# Altium project Flow_Pump.PrjPcb
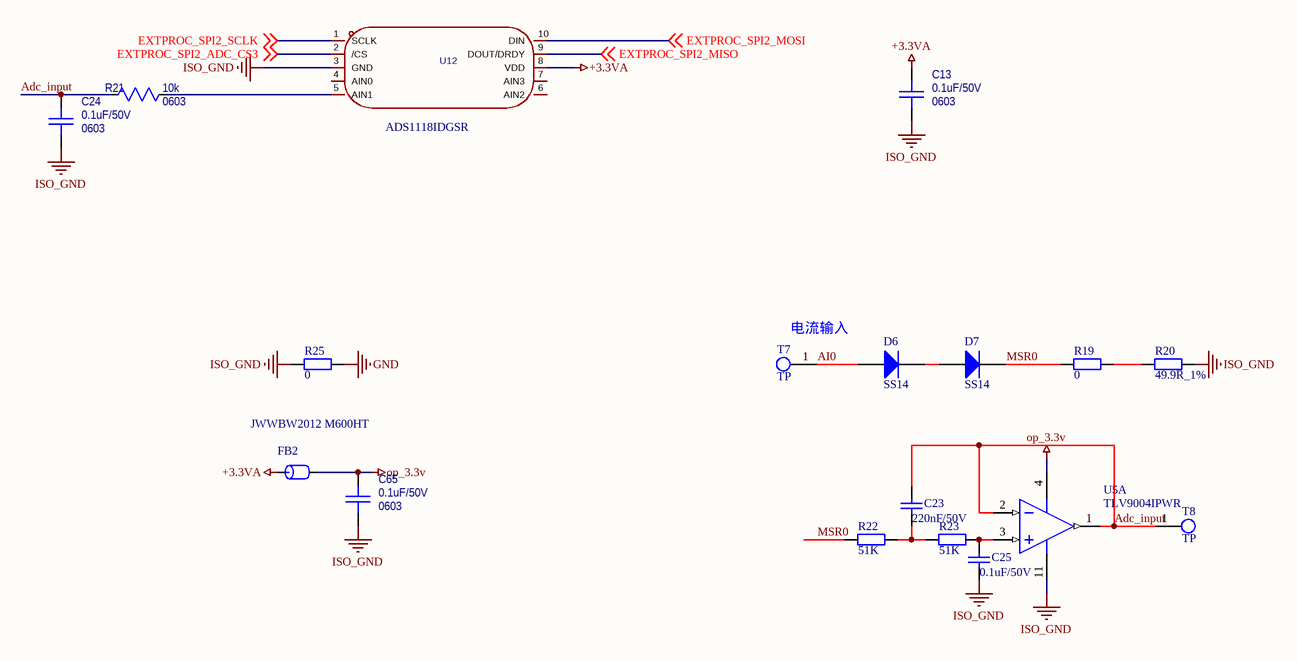
[diagram p0: ai.SchDoc]
5 sheets, 206 parts. Net scope: global (net labels, ports and power ports of the same name join across sheets).
Board file: Flow_Pump.PcbDoc
Sheets:
  ai.SchDoc
  DI_DO.SchDoc
  sensor.SchDoc
  power.SchDoc
  blds.SchDoc

## Sheet ai.SchDoc
size A4; SheetNumber: 3; SheetTotal: 3

### Parts
C13  Package: 0603  [0603C]  (hidden comment: 0.1uF/50V)
C23  220nF/50V  [0603C]
C24  Package: 0603  [0603C]  (hidden comment: 0.1uF/50V)
C25  0.1uF/50V  [0603C]
C65  Package: 0603  [0603C]  (hidden comment: 0.1uF/50V)
D6  SS14  [DO-214AC]
D7  SS14  [DO-214AC]
FB2  JWWBW2012 M600HT  [0805R]
R19  0  [0603R]
R20  49.9R_1%  [0603R]
R21  value 10k  Package: 0603  [0603R]  (hidden comment: 10K/1%)
R22  51K  [0603R]
R23  51K  [0603R]
R25  0  [0603R]
T7  TP  [TPD]
T8  TP  [TPD]
U5  TLV9004IPWR  [TSSOP14]  (part A of 4)
U12  ADS1118IDGSR  [VSSOP-10_L3.0-W3.0-P0.50-LS4.9-BL]

### Nets
+3.3VA: C13.1 FB2.1 U12.8(VDD)
GND: R25.1
ISO_GND: C13.2 C24.2 C25.1 C65.2 R20.1 R25.2 U5.11(GND) U12.3(GND)
op_3.3v: C65.1 FB2.2 U5.4(V+)
Adc_input: C23.2 C24.1 R21.2 T8.1 U5.1(OUT) U5.2(IN-)
AI0: D6.1(A) T7.1
EXTPROC_SPI2_ADC_CS3: U12.2(/CS) ; off-sheet EXTPROC_SPI2_ADC_CS3
EXTPROC_SPI2_MISO: U12.9(DOUT/DRDY) ; off-sheet EXTPROC_SPI2_MISO
EXTPROC_SPI2_MOSI: U12.10(DIN) ; off-sheet EXTPROC_SPI2_MOSI
EXTPROC_SPI2_SCLK: U12.1(SCLK) ; off-sheet EXTPROC_SPI2_SCLK
MSR0: D7.2(K) R19.2 R22.2
NetC23_1: C23.1 R22.1 R23.2
NetC25_2: C25.2 R23.1 U5.3(IN+)
NetD6_2: D6.2(K) D7.1(A)
NetR19_1: R19.1 R20.2
NetR21_1: R21.1 U12.5(AIN1)

Not connected (* = marked no-connect by the designer): U12 4(AIN0) 6(AIN2) 7(AIN3)

### Notes on the sheet
- (near T7) 电流输入

### Library data of the parts
C13 C24 C65 = Capacitor_0603: Capacitor, MLCC; Voltage Rating: [voltage]; Value: 0.1uF/50V
C23 C25 = Cap: Capacitor; Package: 0603
  C25: Value: 0.1uF/50V
D6 D7 = Diode: Default Diode; Package: DO-214AC
FB2 = FB: Package: 0805R
R19 R20 R22 R23 R25 = Res0805M: Package: 0603
R21 = Resistor_0603: Resistor, Standard
U5 = MAX908EPD: Quad High-speed, Ultra Low-power, Single-Supply TTL comparator; Package: TSSOP14
U12 = ADS1118IDGSR_C55347: Package: VSSOP-10_L3.0-W3.0-P0.50-LS4.9-BL
T7 T8 = TP: Package: TPD

## Sheet DI_DO.SchDoc
size A2; SheetNumber: 4; SheetTotal: 4
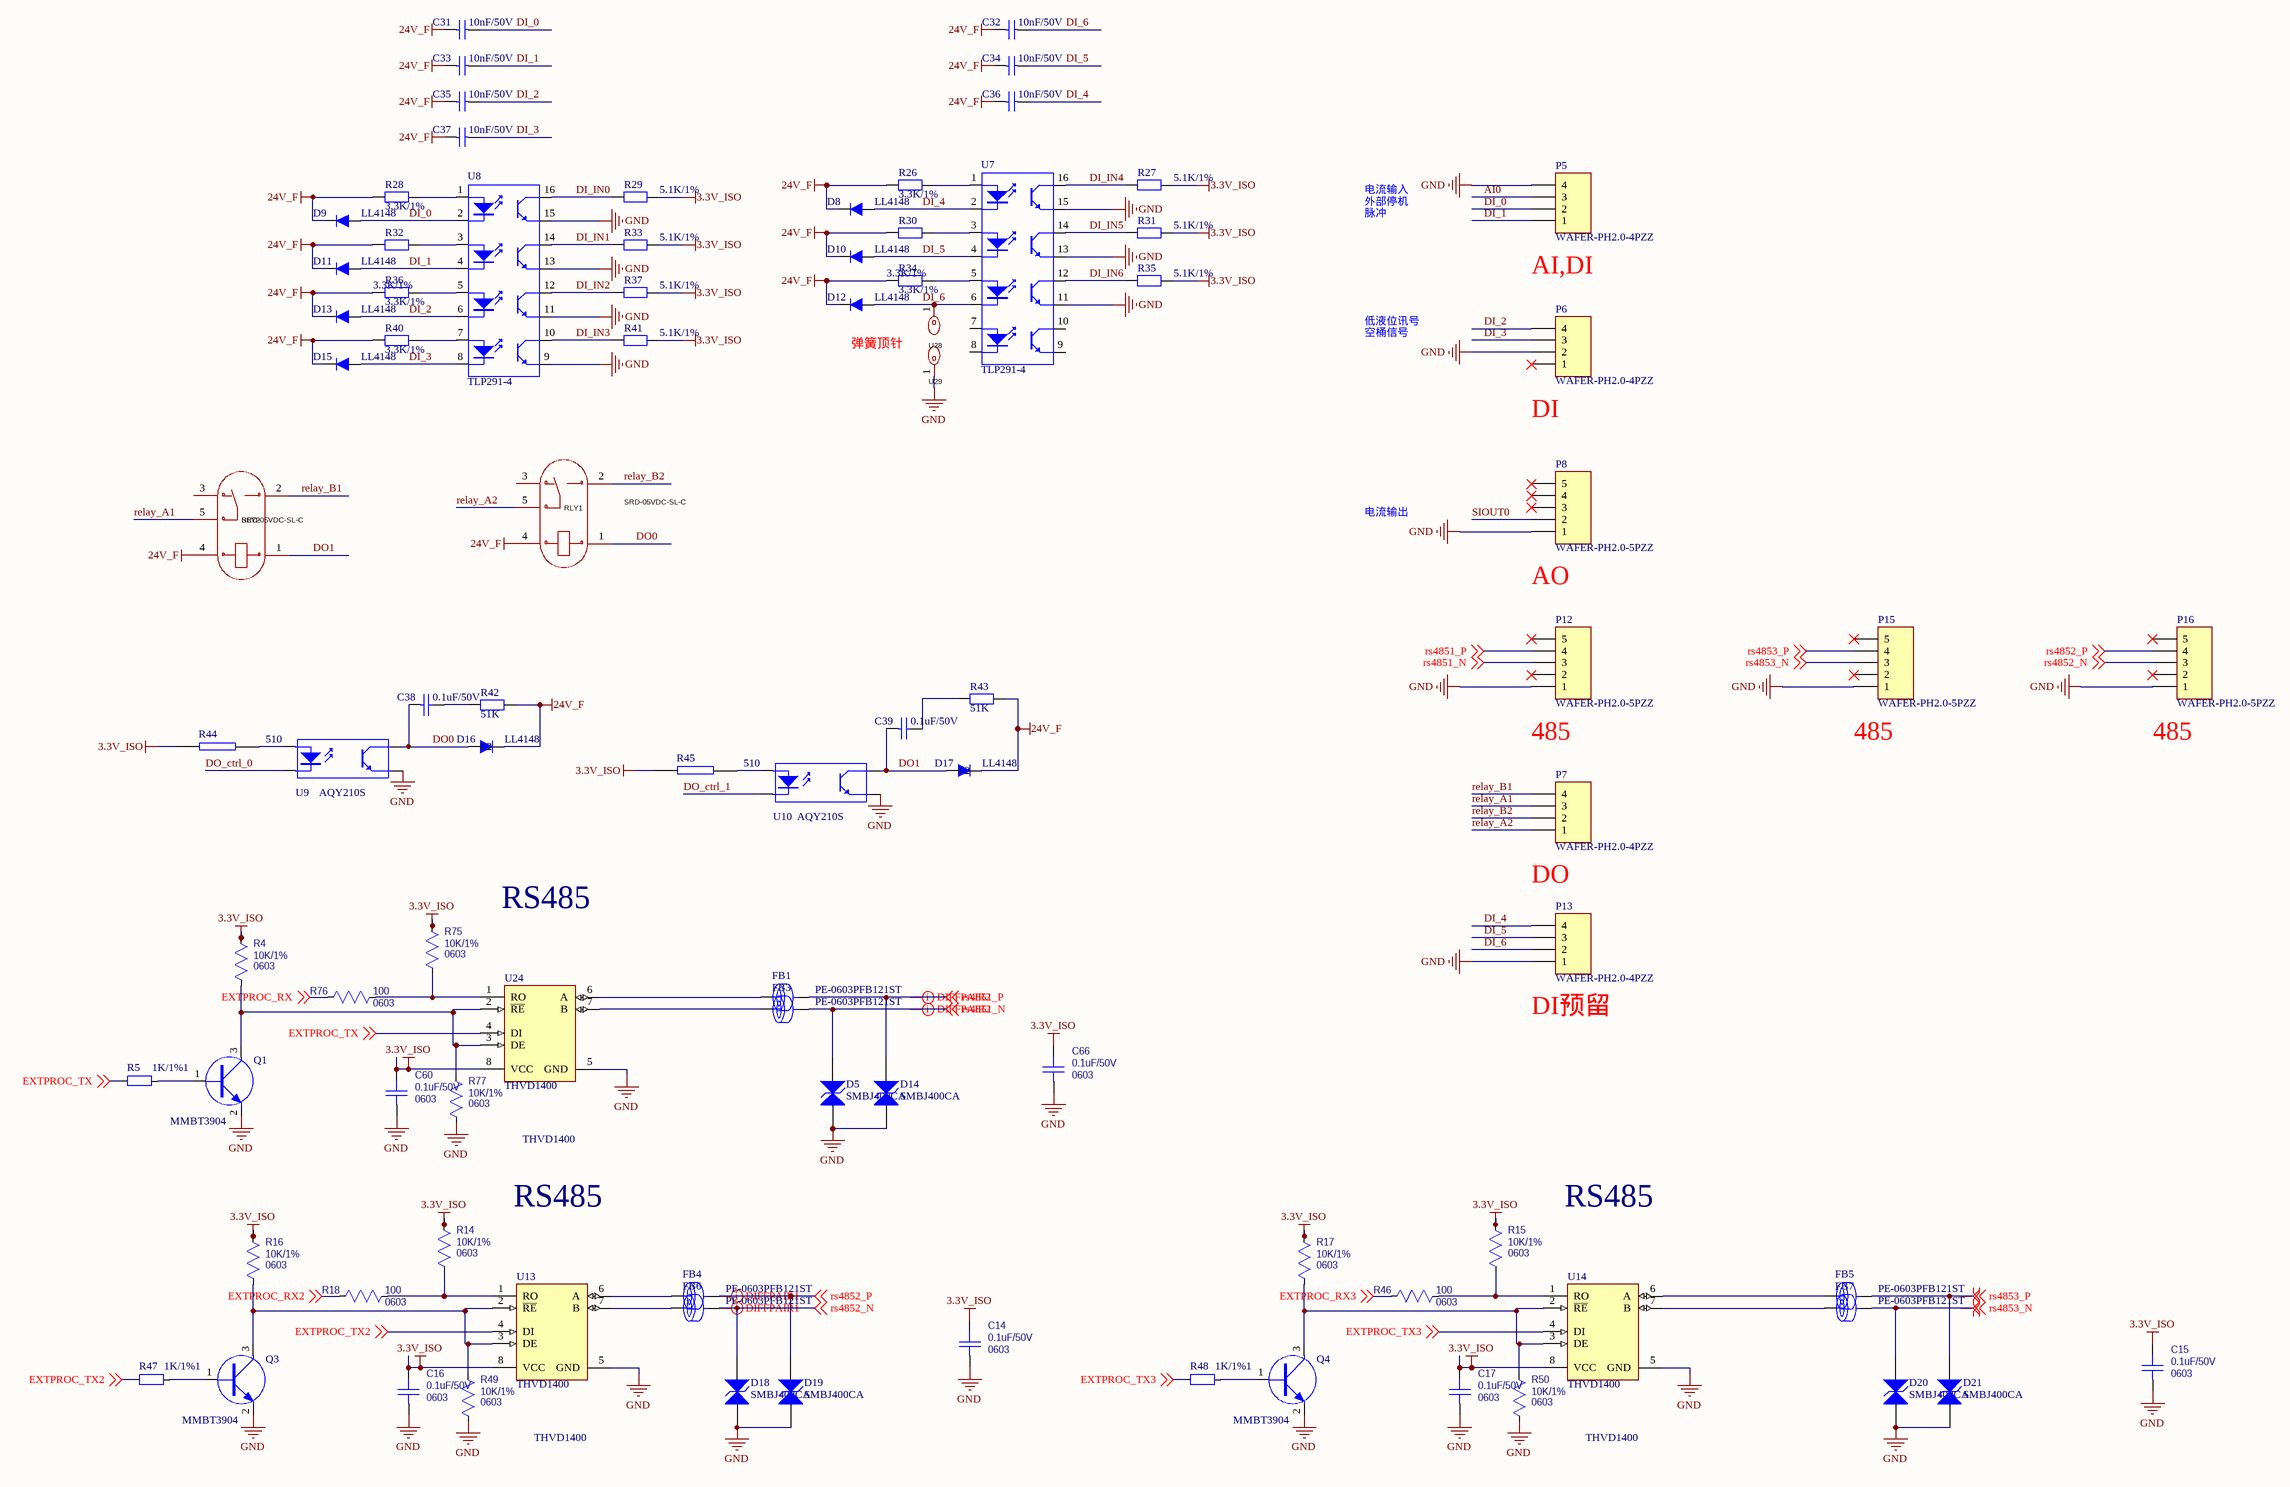
[diagram p1: DI_DO.SchDoc]

### Parts
C14  Package: 0603  [0603C]  (hidden comment: 0.1uF/50V)
C15  Package: 0603  [0603C]  (hidden comment: 0.1uF/50V)
C16  Package: 0603  [0603C]  (hidden comment: 0.1uF/50V)
C17  Package: 0603  [0603C]  (hidden comment: 0.1uF/50V)
C31  10nF/50V  [0603C]
C32  10nF/50V  [0603C]
C33  10nF/50V  [0603C]
C34  10nF/50V  [0603C]
C35  10nF/50V  [0603C]
C36  10nF/50V  [0603C]
C37  10nF/50V  [0603C]
C38  0.1uF/50V  [0603C]
C39  0.1uF/50V  [0603C]
C60  Package: 0603  [0603C]  (hidden comment: 0.1uF/50V)
C66  Package: 0603  [0603C]  (hidden comment: 0.1uF/50V)
D5  SMBJ400CA  [SMB]
D8  LL4148  [DO-213AB/LL34/MiniMELF]
D9  LL4148  [DO-213AB/LL34/MiniMELF]
D10  LL4148  [DO-213AB/LL34/MiniMELF]
D11  LL4148  [DO-213AB/LL34/MiniMELF]
D12  LL4148  [DO-213AB/LL34/MiniMELF]
D13  LL4148  [DO-213AB/LL34/MiniMELF]
D14  SMBJ400CA  [SMB]
D15  LL4148  [DO-213AB/LL34/MiniMELF]
D16  LL4148  [DO-213AB/LL34/MiniMELF]
D17  LL4148  [DO-213AB/LL34/MiniMELF]
D18  SMBJ400CA  [SMB]
D19  SMBJ400CA  [SMB]
D20  SMBJ400CA  [SMB]
D21  SMBJ400CA  [SMB]
FB1  PE-0603PFB121ST  [FBC0603]
FB3  PE-0603PFB121ST  [FBC0603]
FB4  PE-0603PFB121ST  [FBC0603]
FB5  PE-0603PFB121ST  [FBC0603]
FB6  PE-0603PFB121ST  [FBC0603]
FB7  PE-0603PFB121ST  [FBC0603]
P5  WAFER-PH2.0-4PZZ  [CONN#PH2.0-4A]
P6  WAFER-PH2.0-4PZZ  [CONN#PH2.0-4A]
P7  WAFER-PH2.0-4PZZ  [CONN#PH2.0-4A]
P8  WAFER-PH2.0-5PZZ  [CONN#PH2.0-5A]
P12  WAFER-PH2.0-5PZZ  [CONN#PH2.0-5A]
P13  WAFER-PH2.0-4PZZ  [CONN#PH2.0-4A]
P15  WAFER-PH2.0-5PZZ  [CONN#PH2.0-5A]
P16  WAFER-PH2.0-5PZZ  [CONN#PH2.0-5A]
Q1  MMBT3904  [SOT23-3]
Q3  MMBT3904  [SOT23-3]
Q4  MMBT3904  [SOT23-3]
R4  Package: 0603  [0603R]  (hidden comment: 10K/1%)
R5  1K/1%1  [0603r]
R14  Package: 0603  [0603R]  (hidden comment: 10K/1%)
R15  Package: 0603  [0603R]  (hidden comment: 10K/1%)
R16  Package: 0603  [0603R]  (hidden comment: 10K/1%)
R17  Package: 0603  [0603R]  (hidden comment: 10K/1%)
R18  Package: 0603  [0603R]  (hidden comment: 100)
R26  3.3K/1%  [0603R]
R27  5.1K/1%  [0603R]
R28  3.3K/1%  [0603R]
R29  5.1K/1%  [0603R]
R30  3.3K/1%  [0603R]
R31  5.1K/1%  [0603R]
R32  3.3K/1%  [0603R]
R33  5.1K/1%  [0603R]
R34  3.3K/1%  [0603R]
R35  5.1K/1%  [0603R]
R36  3.3K/1%  [0603R]
R37  5.1K/1%  [0603R]
R40  3.3K/1%  [0603R]
R41  5.1K/1%  [0603R]
R42  51K  [0603R]
R43  51K  [0603R]
R44  510  [0603R]
R45  510  [0603R]
R46  Package: 0603  [0603R]  (hidden comment: 100)
R47  1K/1%1  [0603r]
R48  1K/1%1  [0603r]
R49  Package: 0603  [0603R]  (hidden comment: 10K/1%)
R50  Package: 0603  [0603R]  (hidden comment: 10K/1%)
R75  Package: 0603  [0603R]  (hidden comment: 10K/1%)
R76  Package: 0603  [0603R]  (hidden comment: 100)
R77  Package: 0603  [0603R]  (hidden comment: 10K/1%)
RLY1  SRD-05VDC-SL-C  [RELAY-TH_SRD-XXVDC-XL-C]
RLY2  SRD-05VDC-SL-C  [RELAY-TH_SRD-XXVDC-XL-C]
U7  TLP291-4  [SOP16-T]
U8  TLP291-4  [SOP16-T]
U9  AQY210S  [sop4]
U10  AQY210S  [sop4]
U13  THVD1400  [MAXM-S8+4_M]
U14  THVD1400  [MAXM-S8+4_M]
U24  THVD1400  [MAXM-S8+4_M]
U28  (no value)  [CONN-SMD_YTC1P-3015-01]
U29  (no value)  [CONN-SMD_YTC1P-3015-01]

### Nets
3.3V_ISO: C14.1 C15.1 C16.1 C17.1 C60.1 C66.1 R4.2 R14.2 R15.2 R16.2 R17.2 R27.1 R29.1 R31.1 R33.1 R35.1 R37.1 R41.1 R44.2 R45.2 R75.2 U13.8(VCC) U14.8(VCC) U24.8(VCC)  [project net +3.3VA]
24V_F: C31.1 C32.1 C33.1 C34.1 C35.1 C36.1 C37.1 D8.2 D9.2 D10.2 D11.2 D12.2 D13.2 D15.2 D16.2(1) D17.2(1) R26.2 R28.2 R30.2 R32.2 R34.2 R36.2 R40.2 R42.2 R43.2 RLY1.4 RLY2.4
GND: C14.2 C15.2 C16.2 C17.2 C60.2 C66.2 D5.1(A) D14.1(A) D18.1(A) D19.1(A) D20.1(A) D21.1(A) P5.4 P6.2 P8.1 P12.1 P13.1 P15.1 P16.1 Q1.2(E) Q3.2(E) Q4.2(E) R49.1 R50.1 R77.1 U7.11(E) U7.13(E) U7.15(E) U8.9(E) U8.11(E) U8.13(E) U8.15(E) U9.3(E) U10.3(E) U13.5(GND) U14.5(GND) U24.5(GND) U29.1
AI0: P5.3
DI_0: C31.2 D9.1 P5.2 U8.2(K)
DI_1: C33.2 D11.1 P5.1 U8.4(K)
DI_2: C35.2 D13.1 P6.4 U8.6(K)
DI_3: C37.2 D15.1 P6.3 U8.8(K)
DI_4: C36.2 D8.1 P13.4 U7.2(K)
DI_5: C34.2 D10.1 P13.3 U7.4(K)
DI_6: C32.2 D12.1 P13.2 U7.6(K) U28.1
DI_IN0: R29.2 U8.16(C)
DI_IN1: R33.2 U8.14(C)
DI_IN2: R37.2 U8.12(C)
DI_IN3: R41.2 U8.10(C)
DI_IN4: R27.2 U7.16(C)
DI_IN5: R31.2 U7.14(C)
DI_IN6: R35.2 U7.12(C)
DO0: C38.1 D16.1(2) RLY1.1 U9.4(C)
DO1: C39.1 D17.1(2) RLY2.1 U10.4(C)
DO_ctrl_0: U9.2(K)
DO_ctrl_1: U10.2(K)
EXTPROC_RX: R76.2 ; off-sheet EXTPROC_RX
EXTPROC_RX2: R18.2 ; off-sheet EXTPROC_RX2
EXTPROC_RX3: R46.2 ; off-sheet EXTPROC_RX3
EXTPROC_TX: R5.1 U24.4(DI) ; off-sheet EXTPROC_TX
EXTPROC_TX2: R47.1 U13.4(DI) ; off-sheet EXTPROC_TX2
EXTPROC_TX3: R48.1 U14.4(DI) ; off-sheet EXTPROC_TX3
relay_A1: P7.3 RLY2.5
relay_A2: P7.1 RLY1.5
relay_B1: P7.4 RLY2.2
relay_B2: P7.2 RLY1.2
rs4851_N: D5.2(A) FB3.2 P12.3 ; off-sheet rs4851_N
rs4851_P: D14.2(A) FB1.2 P12.4 ; off-sheet rs4851_P
rs4852_N: D18.2(A) FB6.2 P16.3 ; off-sheet rs4852_N
rs4852_P: D19.2(A) FB4.2 P16.4 ; off-sheet rs4852_P
rs4853_N: D20.2(A) FB7.2 P15.3 ; off-sheet rs4853_N
rs4853_P: D21.2(A) FB5.2 P15.4 ; off-sheet rs4853_P
SIOUT0: P8.2
NetC38_2: C38.2 R42.1
NetC39_2: C39.2 R43.1
NetFB1_1: FB1.1 U24.6(A)
NetFB3_1: FB3.1 U24.7(B)
NetFB4_1: FB4.1 U13.6(A)
NetFB5_1: FB5.1 U14.6(A)
NetFB6_1: FB6.1 U13.7(B)
NetFB7_1: FB7.1 U14.7(B)
NetQ1_1: Q1.1(B) R5.2
NetQ1_3: Q1.3(C) R4.1 R77.2 U24.2(~{RE}) U24.3(DE)
NetQ3_1: Q3.1(B) R47.2
NetQ3_3: Q3.3(C) R16.1 R49.2 U13.2(~{RE}) U13.3(DE)
NetQ4_1: Q4.1(B) R48.2
NetQ4_3: Q4.3(C) R17.1 R50.2 U14.2(~{RE}) U14.3(DE)
NetR14_1: R14.1 R18.1 U13.1(RO)
NetR15_1: R15.1 R46.1 U14.1(RO)
NetR26_1: R26.1 U7.1(A)
NetR28_1: R28.1 U8.1(A)
NetR30_1: R30.1 U7.3(A)
NetR32_1: R32.1 U8.3(A)
NetR34_1: R34.1 U7.5(A)
NetR36_1: R36.1 U8.5(A)
NetR40_1: R40.1 U8.7(A)
NetR44_1: R44.1 U9.1(A)
NetR45_1: R45.1 U10.1(A)
NetR75_1: R75.1 R76.1 U24.1(RO)

Not connected (* = marked no-connect by the designer): P6 1*; P8 3* 4* 5*; P12 2* 5*; P15 2* 5*; P16 2* 5*; RLY1 3; RLY2 3; U7 7(A) 8(K) 9(E) 10(C)

### Layout directives
differential pair: rs4851_N, rs4851_P, rs4852_N, rs4852_P, rs4853_N, rs4853_P

### Notes on the sheet
- 电流输入
- 外部停机
- 脉冲
- AI,DI
- (near D12) 弹簧顶针
- 低液位讯号
- 空桶信号
- (near P6) DI
- 电流输出
- AO
- 485
- (near P15) 485
- (near P16) 485
- DO
- RS485
- (near P13) DI预留
- THVD1400

### Library data of the parts
C14-C17 C60 C66 = Capacitor_0603: as C13 on sheet ai; Value: 0.1uF/50V
C31-C37 = Cap: Capacitor; Value: 10nF/50V; Package: 0603
C38 C39 = CAP: Capacitor; Package: 0603; Value: 0.1uF/50V
D5 D14 D18-D21 = SMAJ12CA: Transient Voltage Suppression Diode, 400 W, 33 V, -65 to 150 degC, 2-Pin SMD, RoHS, Tape and Reel; Value: SMBJ400CA; Package: SMB
D8-D13 D15-D17 = LL4148: VISHAY,LL4148,圆柱体MiniMELF100V/2A,ROHS; 版本: V1.00; 名称: 快速开关二极管; 物料编号: APLLY; 制造商: VISHAY; Package: DO-213AB/LL34/MiniMELF
FB1 FB3-FB7 = FBC0603: Ferrite Bead Chip; Value: PE-0603PFB121ST; Package: FBC0603
P5-P7 P13 = Header 4: Header, 4-Pin; Package: CONN#PH2.0-4A
P8 P12 P15 P16 = Header 5: Header, 5-Pin; Package: CONN#PH2.0-5A
Q1 Q3 Q4 = NPN_MMBT3904: Package: SOT23-3
R4 R14-R18 R46 R49 R50 R75-R77 = Resistor_0603: Resistor, Standard
  R4 R14-R17 R49 R50 R75 R77: Value: 10K/1%
  R18 R46 R76: Value: 100
R5 R47 R48 = RES0603: 物料主编码(PN): 150000040; Value: 1K; 序号: 109; 物料名称: 贴片电阻; 精度: ±1%; 规格型号(完整型号): RC1608F103CS/RC0603FR-0710KL; 物料描述: RES,贴片电阻,0603,10k,±1%,1/10W,1.6X0.8X0.45mm,RC1608F103CS/RC0603FR-0710KL; 工作温度: –55°C to 155°C; 制造商: 三星/YAGEO; 器件等级: ——; 物料类型: 表贴电阻; 参数值: 1.00E+04; Package: 0603
R26-R37 R40-R43 = Res0805M: Package: 0603
R44 R45 = RES2: Package: 0603
U7 U8 = TLP281-4: Package: SOP16-T
U9 U10 = Optoisolator1: 4-Pin Phototransistor Optocoupler; Package: sop4
U13 U14 U24 = MAX33071EASA+: RS-485 Half-Duplex Transceiver with ±65V Fault Protection,+3V to +5.5V, -40 to 125 degC, 8-Pin SOIC (S8+4), RoHS, Tube; VOUT: 3.000 V; VIN: 3.2 to 12.6 V; Value: MAX33071EASA+; Package: MAXM-S8+4_M
U28 U29 = YTC1P-3015-01: Package: CONN-SMD_YTC1P-3015-01
RLY1 RLY2 = SRD-05VDC-SL-C: Package: RELAY-TH_SRD-XXVDC-XL-C

## Sheet sensor.SchDoc
size A3
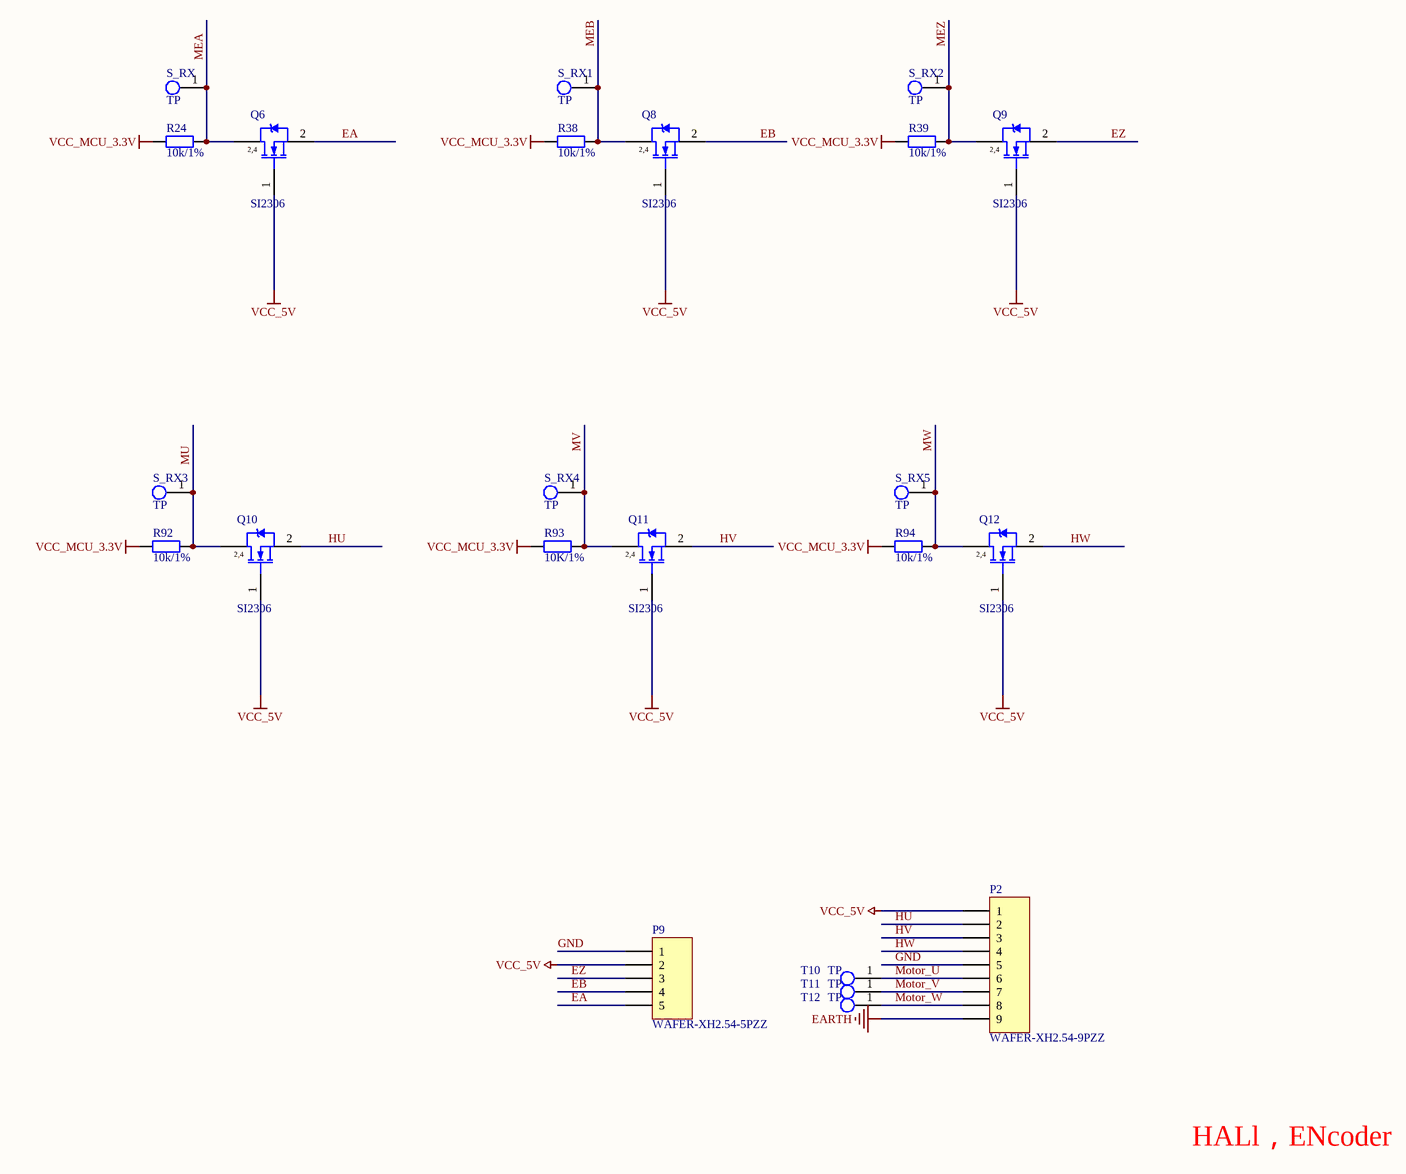
[diagram p2: sensor.SchDoc]

### Parts
P2  WAFER-XH2.54-9PZZ  [XA2.5-9P]
P9  WAFER-XH2.54-5PZZ  [XA2.5-5P]
Q6  SI2306  [SOT23-3]
Q8  SI2306  [SOT23-3]
Q9  SI2306  [SOT23-3]
Q10  SI2306  [SOT23-3]
Q11  SI2306  [SOT23-3]
Q12  SI2306  [SOT23-3]
R24  10k/1%  [0603R]
R38  10k/1%  [0603R]
R39  10k/1%  [0603R]
R92  10k/1%  [0603R]
R93  10K/1%  [0603R]
R94  10k/1%  [0603R]
S_RX  TP  [TPD]
S_RX1  TP  [TPD]
S_RX2  TP  [TPD]
S_RX3  TP  [TPD]
S_RX4  TP  [TPD]
S_RX5  TP  [TPD]
T10  TP  [TPD]
T11  TP  [TPD]
T12  TP  [TPD]

### Nets
EARTH: P2.9
GND: P2.5 P9.1
VCC_5V: P2.1 P9.2 Q6.1(G) Q8.1(G) Q9.1(G) Q10.1(G) Q11.1(G) Q12.1(G)
VCC_MCU_3.3V: R24.1 R38.1 R39.1 R92.1 R93.1 R94.1
EA: P9.5 Q6.2(S)
EB: P9.4 Q8.2(S)
EZ: P9.3 Q9.2(S)
HU: P2.2 Q10.2(S)
HV: P2.3 Q11.2(S)
HW: P2.4 Q12.2(S)
MEA: Q6.3(D) R24.2 S_RX.1
MEB: Q8.3(D) R38.2 S_RX1.1
MEZ: Q9.3(D) R39.2 S_RX2.1
Motor_U: P2.6 T10.1  [project net GSA]
Motor_V: P2.7 T11.1  [project net GSB]
Motor_W: P2.8 T12.1  [project net GSC]
MU: Q10.3(D) R92.2 S_RX3.1
MV: Q11.3(D) R93.2 S_RX4.1
MW: Q12.3(D) R94.2 S_RX5.1

### Notes on the sheet
- HALl，ENcoder
- (in symbol BUK92150-55A) 2,4

### Library data of the parts
P2 = Header 9: Header, 9-Pin; Package: XA2.5-9P
P9 = Header 5: Header, 5-Pin; Package: XA2.5-5P
Q6 Q8-Q12 = BUK92150-55A: Package: SOT23-3
R24 R38 R39 R92-R94 = Res2: Resistor; Package: 0603
S_RX S_RX1-S_RX5 T10-T12 = TP: Package: TPD

## Sheet power.SchDoc
size A2; SPICEModelCacheUWPXBFBI: <root> / <DocumentId>UWPXBFBI</DocumentId> / </root>
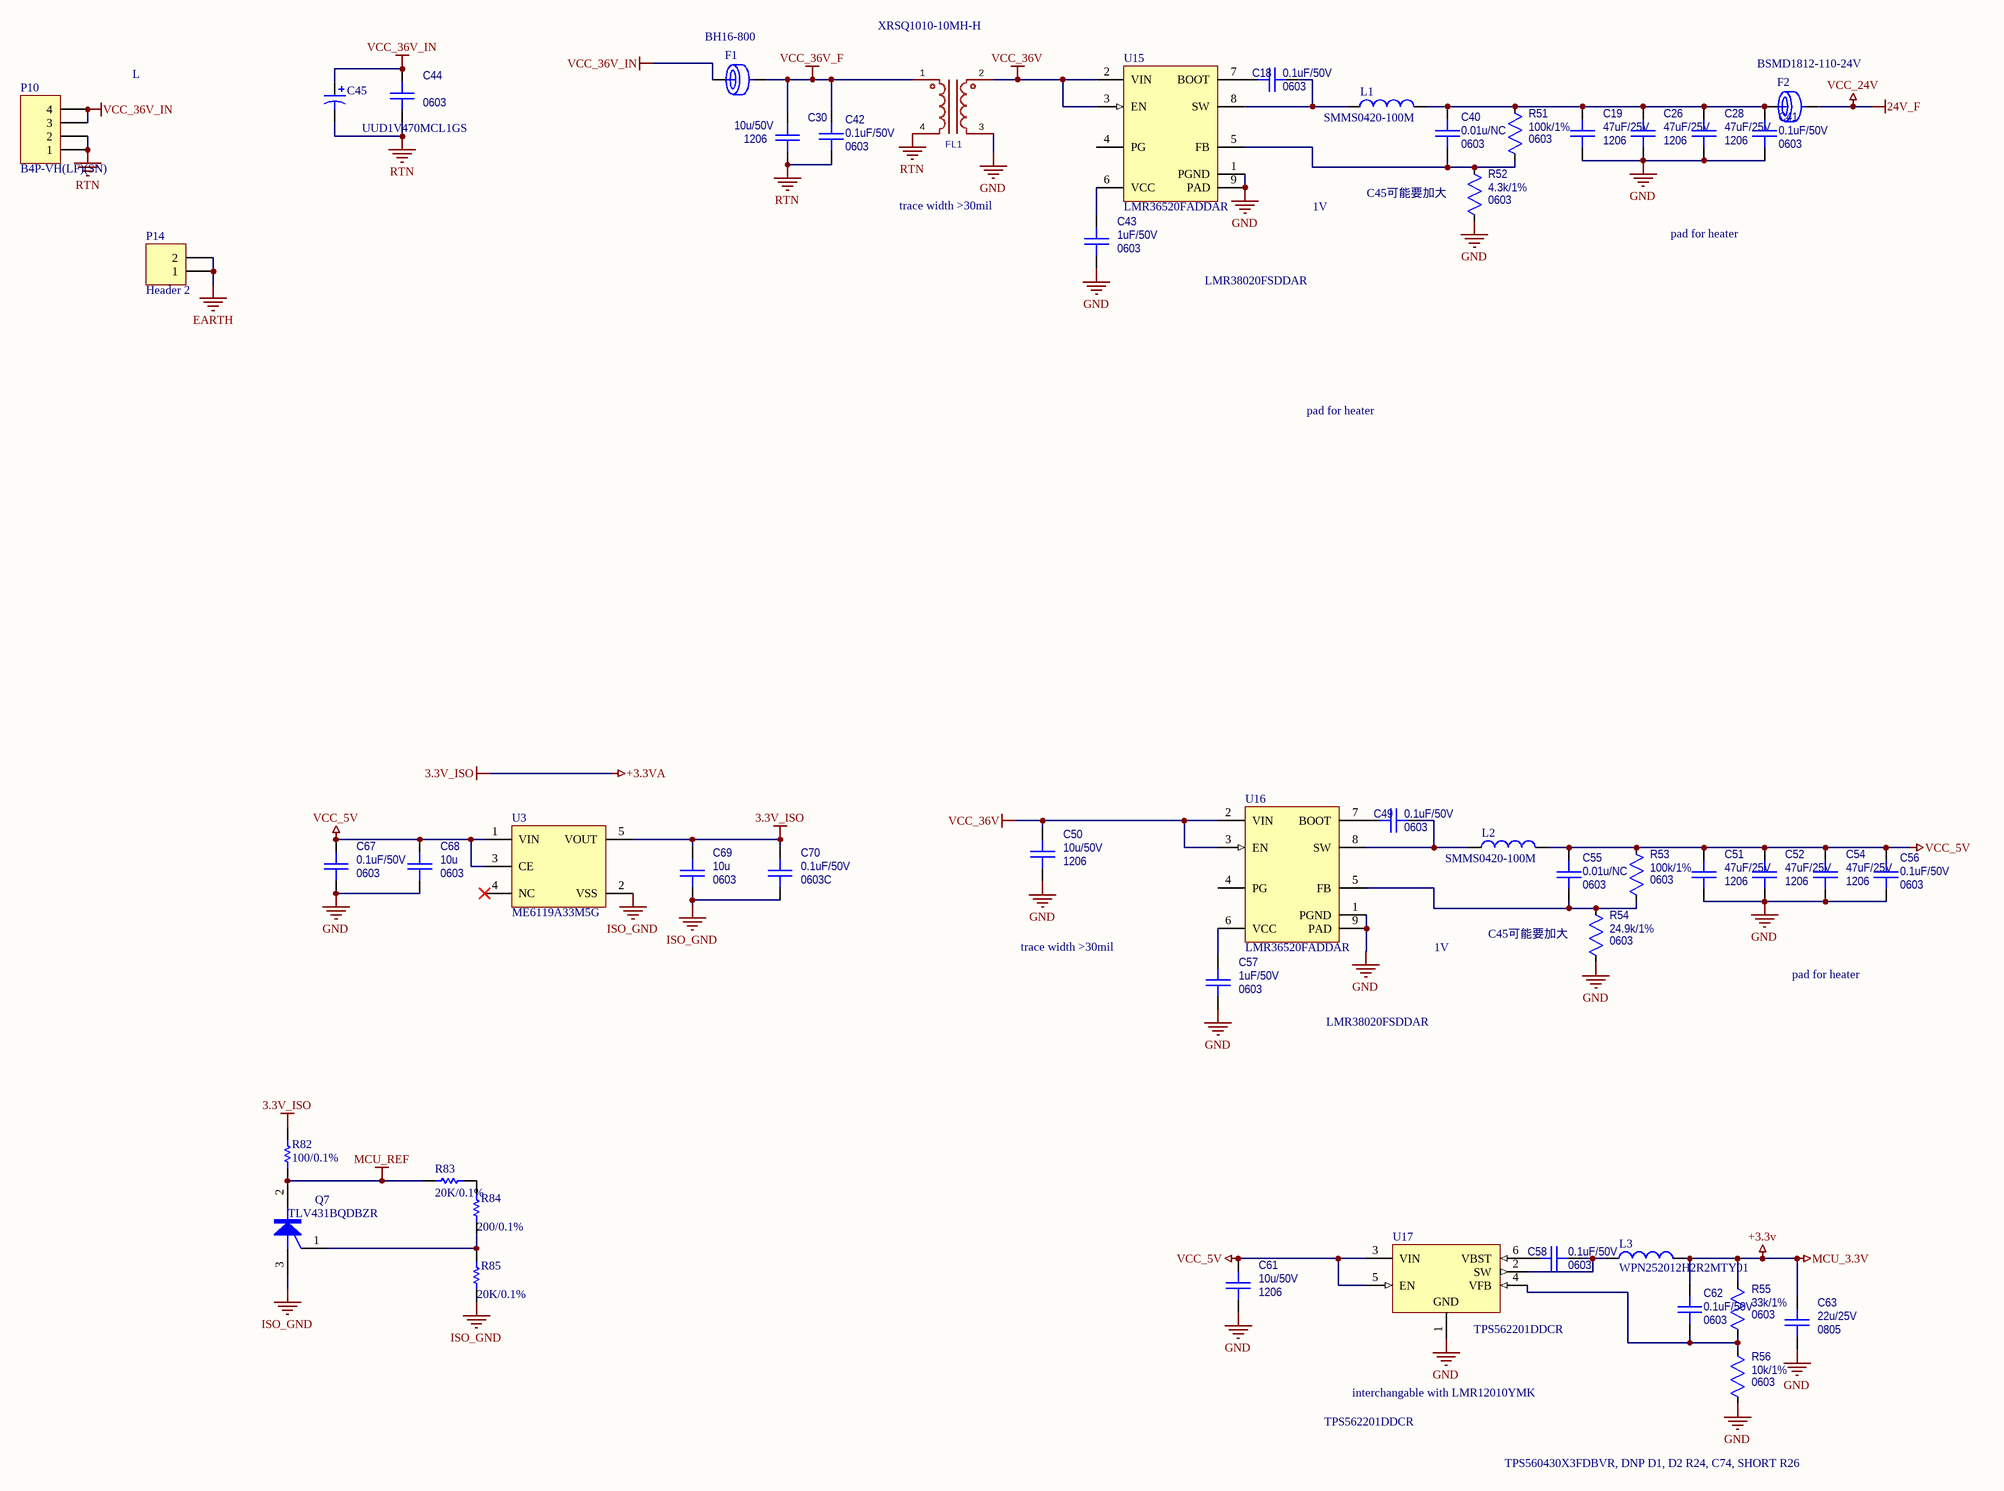
[diagram p3: power.SchDoc]

### Parts
C18  Package: 0603  [0603C]  (hidden comment: 0.1uF/50V)
C19  Package: 1206  [CAPC3216X156N_1206]  (hidden comment: 47uF/25V)
C26  Package: 1206  [CAPC3216X156N_1206]  (hidden comment: 47uF/25V)
C28  Package: 1206  [CAPC3216X156N_1206]  (hidden comment: 47uF/25V)
C30  Package: 1206  [CAPC3216X156N_1206]  (hidden comment: 10u/50V)
C40  value 0.01u/NC  Package: 0603  [0603C]  (hidden comment: 0.01uF/50V)  (no BOM)
C41  Package: 0603  [0603C]  (hidden comment: 0.1uF/50V)
C42  Package: 0603  [0603C]  (hidden comment: 0.1uF/50V)
C43  Package: 0603  [0603C]  (hidden comment: 1uF/50V)
C44  Package: 0603  [0603c]  (hidden comment: 10uF/16V)
C45  UUD1V470MCL1GS  [Φ10×10]
C49  Package: 0603  [0603C]  (hidden comment: 0.1uF/50V)
C50  Package: 1206  [CAPC3216X156N_1206]  (hidden comment: 10u/50V)
C51  Package: 1206  [CAPC3216X156N_1206]  (hidden comment: 47uF/25V)
C52  Package: 1206  [CAPC3216X156N_1206]  (hidden comment: 47uF/25V)
C54  Package: 1206  [CAPC3216X156N_1206]  (hidden comment: 47uF/25V)
C55  value 0.01u/NC  Package: 0603  [0603C]  (hidden comment: 0.01uF/50V)  (no BOM)
C56  Package: 0603  [0603C]  (hidden comment: 0.1uF/50V)
C57  Package: 0603  [0603C]  (hidden comment: 1uF/50V)
C58  Package: 0603  [0603C]  (hidden comment: 0.1uF/50V)
C61  Package: 1206  [CAPC3216X156N_1206]  (hidden comment: 10u/50V)
C62  Package: 0603  [0603C]  (hidden comment: 0.1uF/50V)  (no BOM)
C63  Package: 0805  [CAPC2012X127N_0805]  (hidden comment: 22u/25V)
C67  Package: 0603  [0603C]  (hidden comment: 0.1uF/50V)
C68  value 10u  Package: 0603  [0603c]  (hidden comment: 10uF/16V)
C69  value 10u  Package: 0603  [0603c]  (hidden comment: 10uF/16V)
C70  0.1uF/50V  [0603C]
F1  BH16-800  [FUSE-TH_L14.0-W3.0-P5.10-D0.8-LS1.20]
F2  BSMD1812-110-24V  [1812-F]
FL1  XRSQ1010-10MH-H  [IND-TH_4P-L14.0-W12.0_XRSQ1010-10MH-H]
L1  SMMS0420-100M  [IND-SMD_L4.5-W4.5_SMMS0420]
L2  SMMS0420-100M  [IND-SMD_L4.5-W4.5_SMMS0420]
L3  WPN252012H2R2MTY01  [PULS-BDCD00252012_V]
P10  B4P-VH(LF)(SN)  [CONN-TH_4P-P3.96_HX-VH3.96-4P-ZZ]
P14  Header 2  [插片端子4.8*0.8mm]
Q7  TLV431BQDBZR  [SOT23-3]
R51  Package: 0603  [0603R]  (hidden comment: 100k/1%)
R52  Package: 0603  [0603R]  (hidden comment: 4.3k/1%)
R53  Package: 0603  [0603R]  (hidden comment: 100k/1%)
R54  Package: 0603  [0603R]  (hidden comment: 24.9k/1%)
R55  Package: 0603  [0603R]  (hidden comment: 33k/1%)
R56  Package: 0603  [0603R]  (hidden comment: 10k/1%)
R82  100/0.1%  [0603R]
R83  20K/0.1%  [0603R]
R84  200/0.1%  [0603R]
R85  20K/0.1%  [0603R]
U3  ME6119A33M5G  [MCRN-SOT23-5_V]
U15  LMR36520FADDAR  [DDA0008A_M]
U16  LMR36520FADDAR  [DDA0008A_M]
U17  TPS562201DDCR  [DDC0006A_L]

### Nets
24V_F: F2.2  [also labelled VCC_24V]
+3.3v: C62.1 C63.1 L3.2 R55.2  [also labelled MCU_3.3V]
+3.3VA: C69.1 C70.1 R82.1 U3.5(VOUT)  [also labelled 3.3V_ISO]
EARTH: P14.1 P14.2
GND: C19.2 C26.2 C28.2 C41.2 C43.2 C50.2 C51.2 C52.2 C54.2 C56.2 C57.2 C61.2 C63.2 C67.2 C68.2 FL1.3 R52.1 R54.1 R56.1 U15.1(PGND) U15.9(PAD) U16.1(PGND) U16.9(PAD) U17.1(GND)
ISO_GND: C69.2 C70.2 Q7.3(A) R85.2 U3.2(VSS)
MCU_REF: Q7.2(K) R82.2 R83.1
RTN: C30.2 C42.2 C44.2 C45.2 FL1.4 P10.1 P10.2
VCC_5V: C51.1 C52.1 C54.1 C55.1 C56.1 C61.1 C67.1 C68.1 L2.2 R53.2 U3.1(VIN) U3.3(CE) U17.3(VIN) U17.5(EN)
VCC_36V: C50.1 FL1.2 U15.2(VIN) U15.3(EN) U16.2(VIN) U16.3(EN)
VCC_36V_F: C30.1 C42.1 F1.2 FL1.1
VCC_36V_IN: C44.1 C45.1 F1.1 P10.3 P10.4
NetC18_1: C18.1 U15.7(BOOT)
NetC18_2: C18.2 L1.1 U15.8(SW)
NetC19_1: C19.1 C26.1 C28.1 C40.1 C41.1 F2.1 L1.2 R51.2
NetC40_2: C40.2 R51.1 R52.2 U15.5(FB)
NetC43_1: C43.1 U15.6(VCC)
NetC49_1: C49.1 U16.7(BOOT)
NetC49_2: C49.2 L2.1 U16.8(SW)
NetC55_2: C55.2 R53.1 R54.2 U16.5(FB)
NetC57_1: C57.1 U16.6(VCC)
NetC58_1: C58.1 U17.6(VBST)
NetC58_2: C58.2 L3.1 U17.2(SW)
NetC62_2: C62.2 R55.1 R56.2 U17.4(VFB)
NetQ7_1: Q7.1(G) R84.2 R85.1
NetR83_2: R83.2 R84.1

Not connected (* = marked no-connect by the designer): U3 4(NC)*; U15 4(PG); U16 4(PG)

### Notes on the sheet
- L
- C45可能要加大
- trace width >30mil
- 1V
- pad for heater
- LMR38020FSDDAR
- interchangable with LMR12010YMK
- TPS562201DDCR
- TPS560430X3FDBVR, DNP D1, D2 R24, C74, SHORT R26

### Library data of the parts
C18 C40-C43 C49 C55-C58 C62 = Capacitor_0603: Voltage Rating: [voltage]
  C18 C41 C42 C49 C56 C58 C62: Value: 0.1uF/50V
  C43 C57: Value: 1uF/50V
C19 C26 C28 C30 C50-C52 C54 = Capacitor_1206: Voltage Rating: [voltage]
  C19 C26 C28 C51 C52 C54: Value: 47uF/25V
  C30 C50: Value: 10u/50V
C44 C67-C69 = Capacitor_0603: as C13 on sheet ai
  C67: Value: 0.1uF/50V
C45 = Cap Pol1: Polarized Capacitor (Radial); Value: 220uF/50V; Package: Φ10×10
C61 C63 = Capacitor_0805: Voltage Rating: [voltage]
  C61: Value: 10u/50V
  C63: Value: 22u/25V
C70 = Capacitor_0402: Capacitor, MLCC; Voltage Rating: [voltage]; Package: 0603C; Value: 0.1uF/50V
F1 = FBC0603: Ferrite Bead Chip; Value: BSMD1812-110-24V; Package: FUSE-TH_L14.0-W3.0-P5.10-D0.8-LS1.20
F2 = FBC0603: Ferrite Bead Chip; Value: BSMD1812-110-24V; Package: 1812-F
L1 L2 = 1276AS-H-100M=P2: Metal alloy Power Inductor, 10 uH, ±20%, 1210 (3225); Value: SMMS0420-100M; Package: IND-SMD_L4.5-W4.5_SMMS0420
L3 = BDCD002520122R2MS1: Value: BDCD002520122R2MS1; Package: PULS-BDCD00252012_V
P10 = Header 4: Header, 4-Pin; Package: CONN-TH_4P-P3.96_HX-VH3.96-4P-ZZ
P14 = Header 2: Header, 2-Pin; Package: 插片端子4.8*0.8mm
Q7 = PUT: Programmable Unijunction Transistor; Package: SOT23-3
R51-R56 = Resistor_0603
  R51 R53: Value: 100k/1%
  R52: Value: 4.3k/1%
  R54: Value: 24.9k/1%
  R55: Value: 33k/1%
  R56: Value: 10k/1%
R82-R85 = Res1: Resistor; Package: 0603
  R83 R85: Value: 20K/0.1%
  R84: Value: 200/0.1%
U3 = ME6119C50M5G: High Speed LDO Regulators, Low ESR, 5.0 V, 400 mA, -40 to 125 degC, 5-Pin SOT-23, RoHS, Tape and Reel; Package: MCRN-SOT23-5_V
FL1 = XRSQ1010-10MH-H: Package: IND-TH_4P-L14.0-W12.0_XRSQ1010-10MH-H
U15 U16 = LMR36520FADDAR: Value: LMR36520FADDAR; Package: DDA0008A_M
U17 = TPS562201DDCR: Width: 1.01 mm; Value: TPS562201DDCR; Package: DDC0006A_L

## Sheet blds.SchDoc
size A2
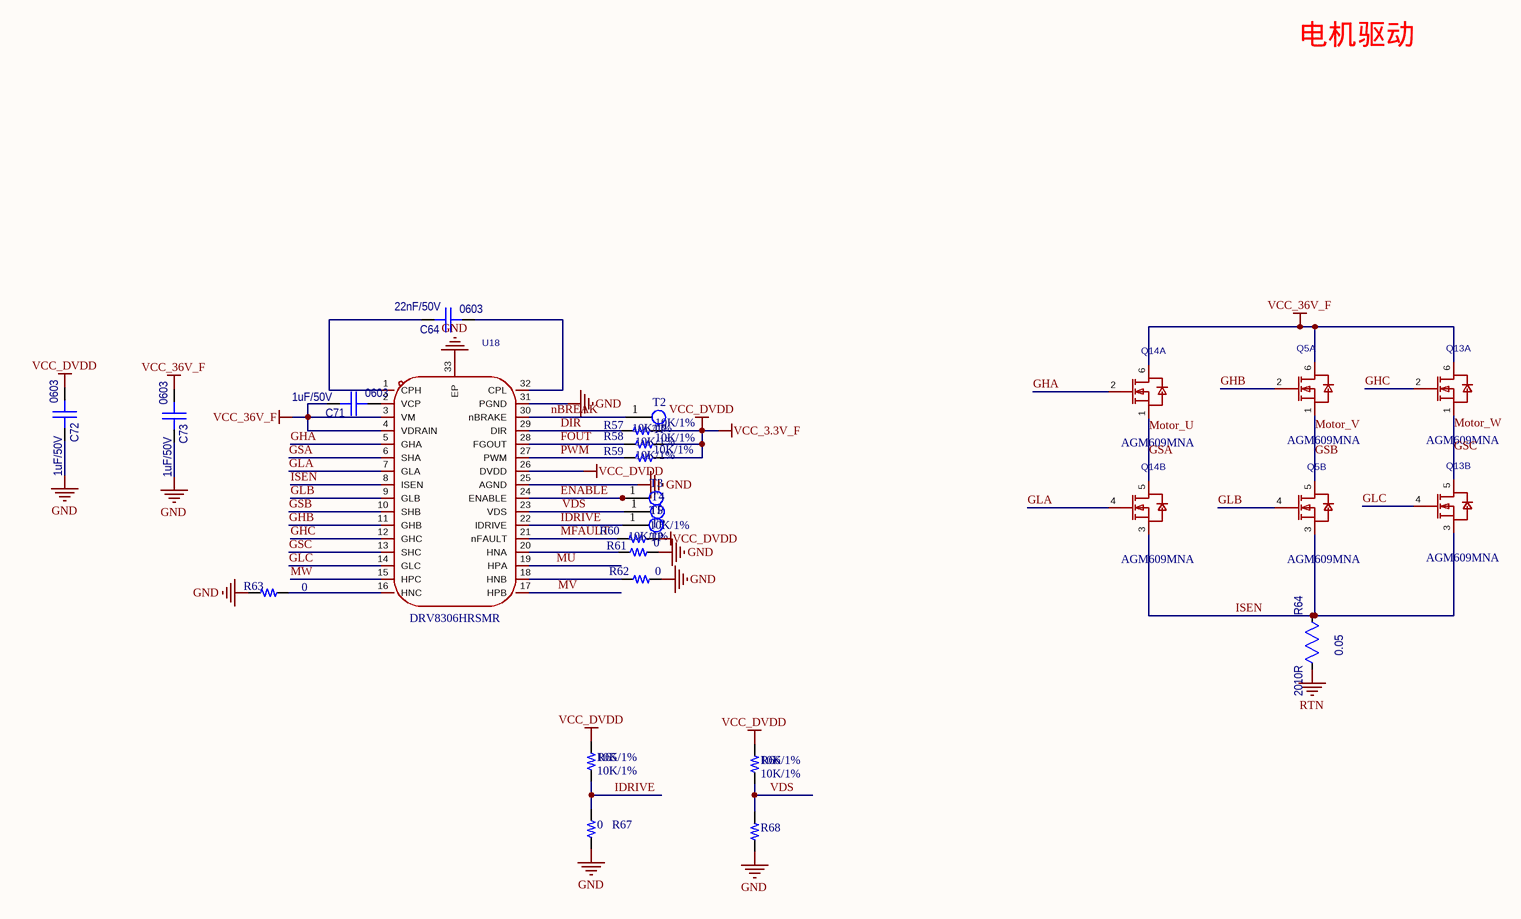
[diagram p4: blds.SchDoc]

### Parts
C64  22nF/50V  Package: 0603  [0603c]
C71  1uF/50V  Package: 0603  [0603C]
C72  1uF/50V  Package: 0603  [0603C]
C73  1uF/50V  Package: 0603  [0603C]
Q5  AGM609MNA  [DFN-8_L5.5-W5.2-P1.27-LS6.0-BL-EP2]  (parts A,B of 2)
Q13  AGM609MNA  [DFN-8_L5.5-W5.2-P1.27-LS6.0-BL-EP2]  (parts A,B of 2)
Q14  AGM609MNA  [DFN-8_L5.5-W5.2-P1.27-LS6.0-BL-EP2]  (parts A,B of 2)
R57  10K/1%  [0603R]
R58  10K/1%  [0603R]
R59  10K/1%  [0603R]
R60  10K/1%  [0603R]
R61  0  [0603R]
R62  0  [0603R]
R63  0  [0603R]
R64  0.05  [2010R]
R65  10K/1%  [0603R]
R66  10K/1%  [0603R]
R67  0  [0603R]
R68  0  [0603R]  (value not drawn)
T2  TP  [TPd]
T3  TP  [TPd]
T4  TP  [TPd]
T5  TP  [TPd]
U18  DRV8306HRSMR  [VQFN-32_L4.0-W4.0-P0.40-BL-EP]

### Nets
GND: C72.2 C73.2 R61.2 R62.2 R63.2 R67.2 R68.2 U18.25(AGND) U18.31(PGND) U18.33(EP)
RTN: R64.1
VCC_3.3V_F: C72.1 R57.2 R58.2 R59.2 R60.2 R65.1 R66.1 U18.26(DVDD)  [also labelled VCC_DVDD]
VCC_36V_F: C71.2 C73.1 Q5.6(D1) Q13.6(D1) Q14.6(D1) U18.3(VM) U18.4(VDRAIN)
DIR: R57.1 U18.29(DIR)
ENABLE: T3.1 U18.24(ENABLE)
FOUT: R58.1 U18.28(FGOUT)
GHA: Q14.2(G1) U18.5(GHA)
GHB: Q5.2(G1) U18.11(GHB)
GHC: Q13.2(G1) U18.12(GHC)
GLA: Q14.4(G2) U18.7(GLA)
GLB: Q5.4(G2) U18.9(GLB)
GLC: Q13.4(G2) U18.14(GLC)
GSA: Q14.1(S1) Q14.5(D2) U18.6(SHA)  [also labelled Motor_U]
GSB: Q5.1(S1) Q5.5(D2) U18.10(SHB)  [also labelled Motor_V]
GSC: Q13.1(S1) Q13.5(D2) U18.13(SHC)  [also labelled Motor_W]
IDRIVE: R65.2 R67.1 T5.1 U18.22(IDRIVE)
ISEN: Q5.3(S2) Q13.3(S2) Q14.3(S2) R64.2 U18.8(ISEN)
MFAULT: R60.1 U18.21(nFAULT)
MU: U18.19(HPA)
MV: U18.17(HPB)
MW: U18.15(HPC)
nBREAK: T2.1 U18.30(nBRAKE)
PWM: R59.1 U18.27(PWM)
VDS: R66.2 R68.1 T4.1 U18.23(VDS)
NetC64_1: C64.1 U18.32(CPL)
NetC64_2: C64.2 U18.1(CPH)
NetC71_1: C71.1 U18.2(VCP)
NetR61_1: R61.1 U18.20(HNA)
NetR62_1: R62.1 U18.18(HNB)
NetR63_1: R63.1 U18.16(HNC)

### Notes on the sheet
- 电机驱动

### Library data of the parts
C64 C71-C73 = Capacitor_0603: as C13 on sheet ai
  C64: Value: 22nF/50V
  C71-C73: Value: 1uF/50V
R57-R63 R65-R68 = R: Package: 0603
  R57-R60 R65 R66: Value: 10K/1%
  R61-R63 R67 R68: Value: 0
R64 = Resistor_0603: Resistor, Standard; Package: 2010R; Value: 0.05
Q5 Q13 Q14 = AGM609MNA: Package: DFN-8_L5.5-W5.2-P1.27-LS6.0-BL-EP2
U18 = DRV8306HRSMR: Package: VQFN-32_L4.0-W4.0-P0.40-BL-EP

## Nets that join several sheets
24V_F: DI_DO (27 pins), power (F2.2)
+3.3VA: ai (C13.1 FB2.1 U12.8), DI_DO (24 pins), power (C69.1 C70.1 R82.1 U3.5)
EARTH: sensor (P2.9), power (P14.1 P14.2)
GND: ai (R25.1), DI_DO (38 pins), sensor (P2.5 P9.1), power (24 pins), blds (10 pins)
ISO_GND: ai (8 pins), power (5 pins)
RTN: power (7 pins), blds (R64.1)
VCC_5V: sensor (8 pins), power (14 pins)
VCC_36V_F: power (C30.1 C42.1 F1.2 FL1.1), blds (7 pins)
AI0: ai (D6.1 T7.1), DI_DO (P5.3)
GSA: sensor (P2.6 T10.1), blds (Q14.1 Q14.5 U18.6)
GSB: sensor (P2.7 T11.1), blds (Q5.1 Q5.5 U18.10)
GSC: sensor (P2.8 T12.1), blds (Q13.1 Q13.5 U18.13)
MU: sensor (Q10.3 R92.2 S_RX3.1), blds (U18.19)
MV: sensor (Q11.3 R93.2 S_RX4.1), blds (U18.17)
MW: sensor (Q12.3 R94.2 S_RX5.1), blds (U18.15)

## Assembly variants
Variant of Flow_PumpV1.2: not fitted F1 FL1 P1 R67 R68 T2 T3 T4 T5